# EAGLE schematic promini(2) (EAGLE 7.6.0)
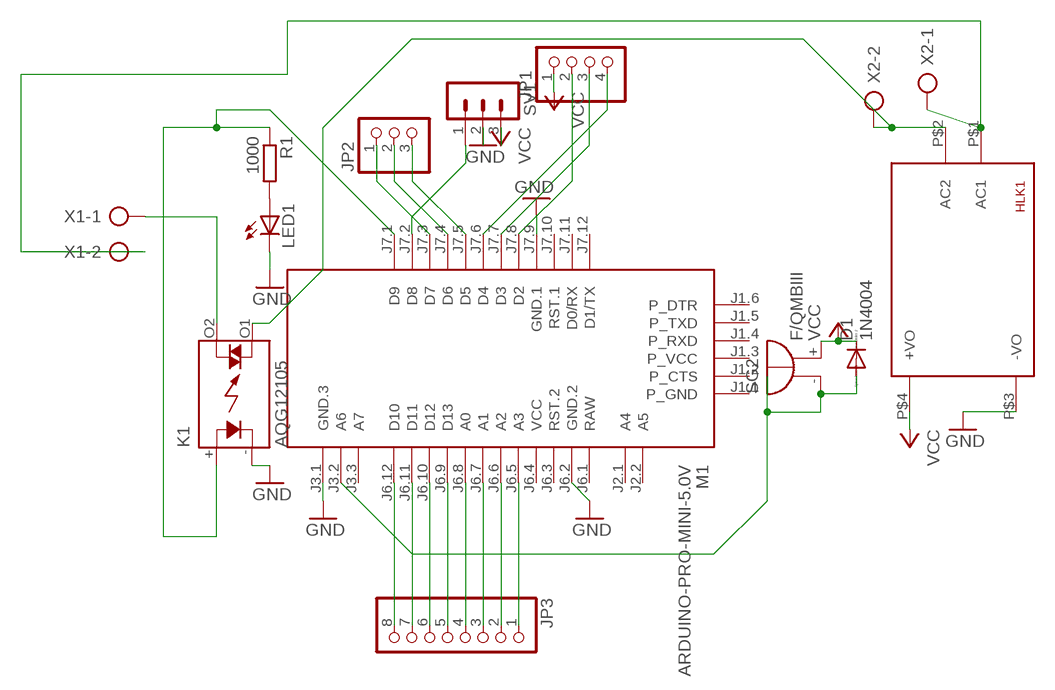
[diagram p0: schematic, sheet 1]

## Parts
D1  1N4004  [DO41-10]
HLK1  HLK-PM013W  [HLK-PM01]
JP1  PINHD-1X4  [1X04]
JP2  PINHD-1X3  [1X03]
JP3  PINHD-1X8  [1X08]
K1  AQG12105  [AQG]
LED1  LED5MM  [LED5MM]
M1  ARDUINO-PRO-MINI-5.0V  [ARDUINO-PRO-MINI]
R1  1000  R-EU_0207/10  [0207/10]
SG2  F/QMBIII  [F/QMBIII]
SV1  MA03-1  [MA03-1]
X1  AK300/2  [AK300/2]
X2  AK300/2  [AK300/2]

## Nets
D2: K1.+(A) M1.J7.1(D9) R1.1
D4: D1.A M1.J3.2(A6) SG2.-(+)
GND: HLK1.P$3(-VO) K1.-(K) LED1.K(C) M1.J3.1(GND.3) M1.J6.2(GND.2) M1.J7.9(GND.1) SV1.2
L: HLK1.P$1(AC1) X1.2 X2.1
N$1: K1.O2(DS1) X1.1
N$3: JP1.2 M1.J7.8(D2)
N$4: LED1.A R1.2
N$5: M1.J7.2(D8) SV1.1
N$6: JP1.3 M1.J7.7(D3)
N$7: JP1.4 M1.J7.6(D4)
N$12: HLK1.P$2(AC2) K1.O1(DS2) X2.2
N$13: JP2.3 M1.J7.5(D5)
N$14: JP2.2 M1.J7.4(D6)
N$15: JP2.1 M1.J7.3(D7)
N$16: JP3.8 M1.J6.12(D10)
N$17: JP3.7 M1.J6.11(D11)
N$18: JP3.6 M1.J6.10(D12)
N$19: JP3.5 M1.J6.9(D13)
N$20: JP3.4 M1.J6.8(A0)
N$21: JP3.3 M1.J6.7(A1)
N$22: JP3.2 M1.J6.6(A2)
N$23: JP3.1 M1.J6.5(A3)
VCC: D1.C HLK1.P$4(+VO) JP1.1 SG2.+(-) SV1.3
Unconnected: M1.J1.1(P_GND) M1.J1.2(P_CTS) M1.J1.3(P_VCC) M1.J1.4(P_RXD) M1.J1.5(P_TXD) M1.J1.6(P_DTR) M1.J2.1(A4) M1.J2.2(A5) M1.J3.3(A7) M1.J6.3(RST.2) M1.J7.10(RST.1) M1.J7.11(D0/RX) M1.J7.12(D1/TX)

## Power pins joined to a net without a drawn wire
RAW: M1.J6.1(RAW)
VCC: M1.J6.4(VCC)

## Library data of the parts
D1 = diode:1N4004: DIODE general purpose rectifier, 1 A
HLK1 = HLK-PM01:HLK-PM01: Hi-Link Power Supply HLK-PM01 3W Author: Ahmed Said <https://github.com/AhmedSaid/EAGLELibraries>
JP1 = pinhead:PINHD-1X4: PIN HEADER
JP2 = pinhead:PINHD-1X3: PIN HEADER
JP3 = pinhead:PINHD-1X8: PIN HEADER
K1 = relay:AQG*: SOLID STATE RELAY NAiS Zero-cross, Non zero-cross Source: http://www.mew-europe.com/.. en_ds_61611_0000.pdf; MF: AROMAT/ MATSUSHITA; MPN: AQG12105; OC_FARNELL: unknown; OC_NEWARK: 20J4759
LED1 = led:LED: LED OSRAM: - CHIPLED LG R971, LG N971, LY N971, LG Q971, LY Q971, LO R971, LY R971 LH N974, LH R974 LS Q976, LO Q976, LY Q976 LO Q996 - Hyper CHIPLED LW Q18S LB Q993, LB Q99A, LB R99A - SideLED LS A670, LO A670, LY A670, LG A670, LP A670 LB A673, LV A673, LT A673, LW A673 LH A674 LY A675 LS A676, LA A676, LO A676, LY A676, LW A676 LS A679, LY A679, LG A679 - Hyper Micro SIDELED® LS Y876, LA Y876, LO Y876, LY Y876 LT Y87S - SmartLED LW L88C, LW L88S LB L89C, LB L89S, LG L890 LS L89K, LO L89K, LY L89K LS L896, LA L896, LO L896, LY L896 - TOPLED LS T670, LO T670, LY T670, LG T670, LP T670 LSG T670, LSP T670, LSY T670, LOP T670, LYG T670 LG T671, LOG T671, LSG T671 LB T673, LV T673, LT T673, LW T673 LH T674 LS T676, LA T676, LO T676, LY T676, LB T676, LH T676, LSB T676, LW T676 LB T67C, LV T67C, LT T67C, LS T67K, LO T67K, LY T67K, LW E67C LS E67B, LA E67B, LO E67B, LY E67B, LB E67C, LV E67C, LT E67C LW T67C LS T679, LY T679, LG T679 LS T770, LO T770, LY T770, LG T770, LP T770 LB T773, LV T773, LT T773, LW T773 LH T774 LS E675, LA E675, LY E675, LS T675 LS T776, LA T776, LO T776, LY T776, LB T776 LHGB T686 LT T68C, LB T68C - Hyper Mini TOPLED® LB M676 - Mini TOPLED Santana® LG M470 LS M47K, LO M47K, LY M47K Source: http://www.osram.convergy.de LUXEON: - LUMILED® LXK2-PW12-R00, LXK2-PW12-S00, LXK2-PW14-U00, LXK2-PW14-V00 LXK2-PM12-R00, LXK2-PM12-S00, LXK2-PM14-U00 LXK2-PE12-Q00, LXK2-PE12-R00, LXK2-PE12-S00, LXK2-PE14-T00, LXK2-PE14-U00 LXK2-PB12-K00, LXK2-PB12-L00, LXK2-PB12-M00, LXK2-PB14-N00, LXK2-PB14-P00, LXK2-PB14-Q00 LXK2-PR12-L00, LXK2-PR12-M00, LXK2-PR14-Q00, LXK2-PR14-R00 LXK2-PD12-Q00, LXK2-PD12-R00, LXK2-PD12-S00 LXK2-PH12-R00, LXK2-PH12-S00 LXK2-PL12-P00, LXK2-PL12-Q00, LXK2-PL12-R00 Source: www.luxeon.com KINGBRIGHT: KA-3528ASYC Source: www.kingbright.com
M1 = diy-modules:ARDUINO-PRO-MINI-*: Arduino Pro Mini and compatible devices More details available here: https://www.arduino.cc/en/Main/ArduinoBoardProMini Click here to find device on ebay.com <http://www.ebay.com/sch/arduino+pro+mini>
R1 = resistor:R-EU_: RESISTOR, European symbol
SG2 = buzzer:F/QMBIII: BUZZER Source: Buerklin; OC_FARNELL: unknown; OC_NEWARK: unknown
SV1 = con-lstb:MA03-1: PIN HEADER; OC_FARNELL: unknown; OC_NEWARK: unknown
X1 X2 = con-ptr500:AK300/2: CONNECTOR; OC_FARNELL: unknown; OC_NEWARK: unknown